# Altium schematic sheet Communication Ethernet DP.SchDoc
size A4
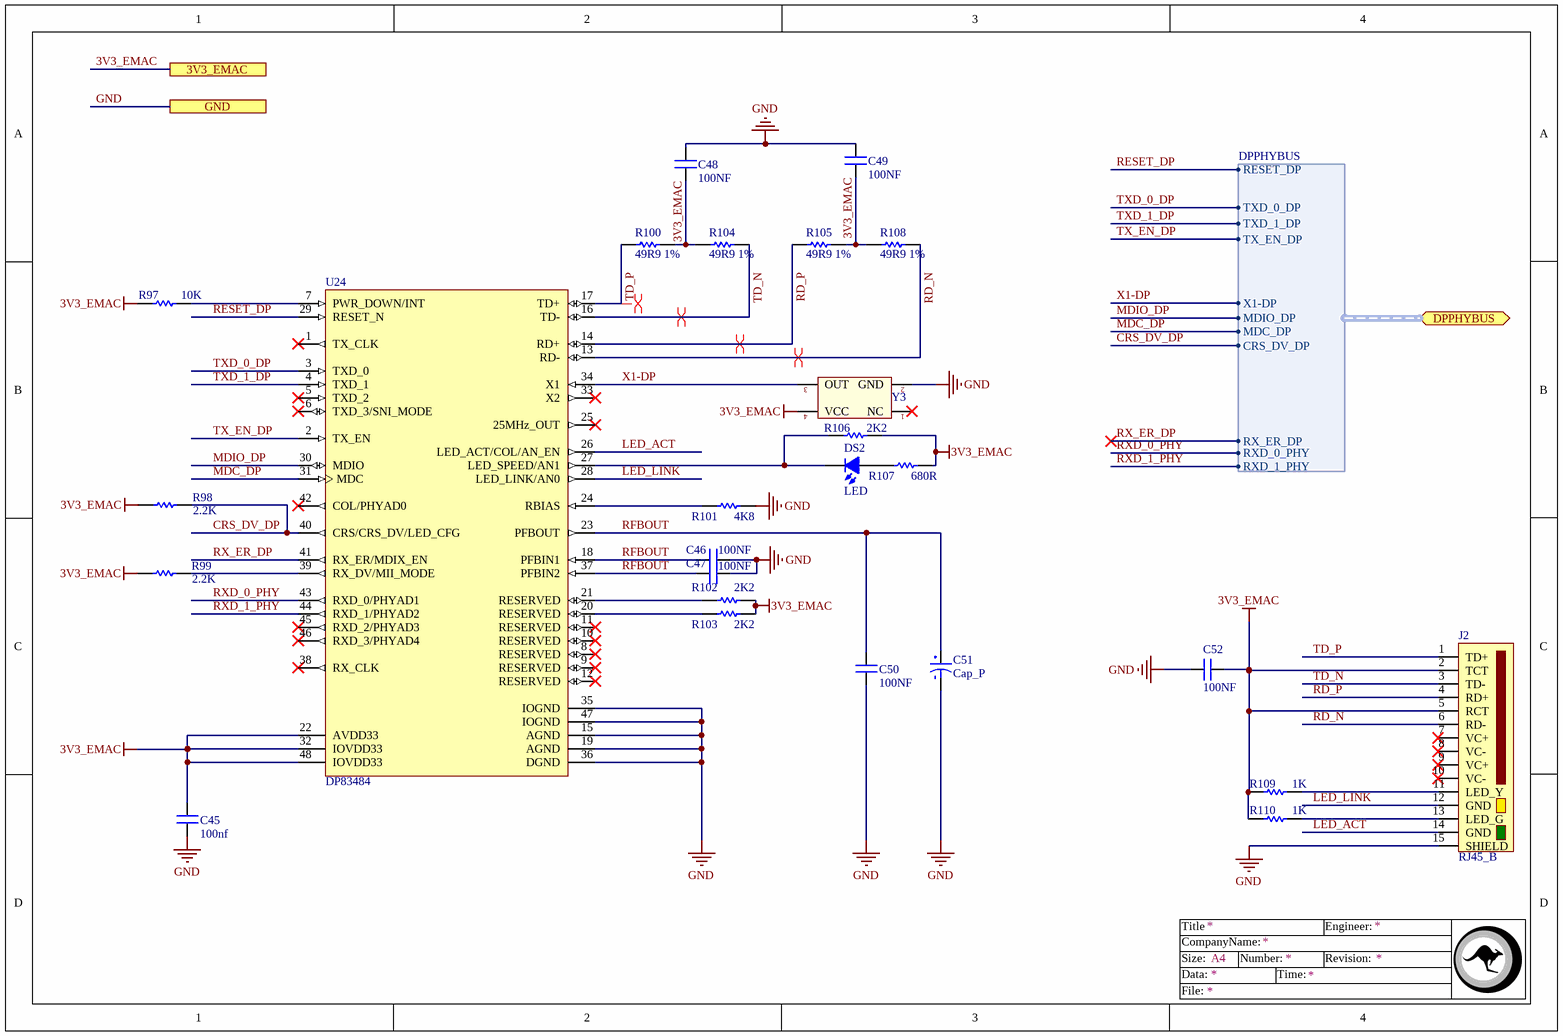
[diagram p0: Communication Ethernet DP.SchDoc]

## Parts
C45  100nf  [Cap0805]
C46  100NF  [Cap0805]
C47  100NF  [Cap0805]
C48  100NF  [Cap0805]
C49  100NF  [Cap0805]
C50  100NF  [Cap0805]
C51  Cap_P  [Cap_4mm]
C52  100NF  [Cap0805]
DS2  LED  [Led0805]
J2  RJ45_B  [RJ45_B]
R97  10K  [R0805]
R98  2.2K  [R0805]
R99  2.2K  [R0805]
R100  49R9 1%  [R0805]
R101  4K8  [R0805]
R102  2K2  [R0805]
R103  2K2  [R0805]
R104  49R9 1%  [R0805]
R105  49R9 1%  [R0805]
R106  2K2  [R0805]
R107  680R  [R0805]
R108  49R9 1%  [R0805]
R109  1K  [R0805]
R110  1K  [R0805]
U24  DP83484  [DP83484]
Y3  Oscillator  [Crystall 50Mhz]  (value not drawn)

## Ports
3V3_EMAC, DPPHYBUS (bidir, harness DPPHYBUS), GND

## Harnesses
DPPHYBUS: RESET_DP, TXD_0_DP, X1-DP, TXD_1_DP, TX_EN_DP, MDIO_DP, MDC_DP, CRS_DV_DP, RX_ER_DP, RXD_0_PHY, RXD_1_PHY

## Nets
3V3_EMAC: C45.2 C48.1 C49.1 C52.1 J2.2(TCT) J2.5(RCT) R97.2 R98.2 R99.2 R100.2 R102.1 R103.1 R104.1 R105.2 R106.1 R107.1 R108.1 R109.1 R110.1 U24.22(AVDD33) U24.32(IOVDD33) U24.48(IOVDD33) Y3.4(VCC) ; port 3V3_EMAC
GND: C45.1 C46.2 C47.2 C48.2 C49.2 C50.1 C51.1 C52.2 J2.15(SHIELD) R101.1 U24.15(AGND) U24.19(AGND) U24.35(IOGND) U24.36(DGND) U24.47(IOGND) Y3.2(GND) ; port GND
CRS_DV_DP: R98.1 U24.40(CRS/CRS_DV/LED_CFG) ; port DPPHYBUS.CRS_DV_DP
LED_ACT: J2.14(GND) U24.26(LED_ACT/COL/AN_EN)
LED_LINK: J2.12(GND) U24.28(LED_LINK/AN0)
MDC_DP: U24.31(MDC) ; port DPPHYBUS.MDC_DP
MDIO_DP: U24.30(MDIO) ; port DPPHYBUS.MDIO_DP
RD_N: J2.6(RD-) R108.2 U24.13(RD-)
RD_P: J2.4(RD+) R105.1 U24.14(RD+)
RESET_DP: U24.29(RESET_N) ; port DPPHYBUS.RESET_DP
RFBOUT: C46.1 C47.1 C50.2 C51.2 U24.18(PFBIN1) U24.23(PFBOUT) U24.37(PFBIN2)
RX_ER_DP: U24.41(RX_ER/MDIX_EN) ; port DPPHYBUS.RX_ER_DP
RXD_0_PHY: U24.43(RXD_0/PHYAD1) ; port DPPHYBUS.RXD_0_PHY
RXD_1_PHY: U24.44(RXD_1/PHYAD2) ; port DPPHYBUS.RXD_1_PHY
TD_N: J2.3(TD-) R104.2 U24.16(TD-)
TD_P: J2.1(TD+) R100.1 U24.17(TD+)
TX_EN_DP: U24.2(TX_EN) ; port DPPHYBUS.TX_EN_DP
TXD_0_DP: U24.3(TXD_0) ; port DPPHYBUS.TXD_0_DP
TXD_1_DP: U24.4(TXD_1) ; port DPPHYBUS.TXD_1_DP
X1-DP: U24.34(X1) Y3.3(OUT) ; port DPPHYBUS.X1-DP
NetDS2_A: DS2.A R107.2
NetDS2_K: DS2.K R106.2 U24.27(LED_SPEED/AN1)
NetJ2_11: J2.11(LED_Y) R109.2
NetJ2_13: J2.13(LED_G) R110.2
NetR97_1: R97.1 U24.7(PWR_DOWN/INT)
NetR99_1: R99.1 U24.39(RX_DV/MII_MODE)
NetR101_2: R101.2 U24.24(RBIAS)
NetR102_2: R102.2 U24.21(RESERVED)
NetR103_2: R103.2 U24.20(RESERVED)

Not connected (* = marked no-connect by the designer): J2 7(VC+)* 8(VC-)* 9(VC+)* 10(VC-)*; U24 1(TX_CLK)* 5(TXD_2)* 6(TXD_3/SNI_MODE)* 8(RESERVED)* 9(RESERVED)* 10(RESERVED)* 11(RESERVED)* 12(RESERVED)* 25(25MHz_OUT)* 33(X2)* 38(RX_CLK)* 42(COL/PHYAD0)* 45(RXD_2/PHYAD3)* 46(RXD_3/PHYAD4)*; Y3 1(NC)*

## Layout directives
differential pair: RD_N, RD_P, TD_N, TD_P

## Notes on the sheet
- Title
- Size:
- Data:
- CompanyName:
- A4
- Number:
- Time:
- Revision:
- Engineer:
- File:

## Library data of the parts
C45-C50 C52 = Cap: Surface mount Capacitor
C51 = Cap_P: Polarity
J2 = RJ45_B: Ethernet Connector
R97-R110 = Resistor
U24 = DP83484: Ethernet PHY